# Altium schematic sheet 主控模块.SchDoc: RC1562L
size A4; Organization: 广东工程职业技术学院; Address1: 邹睿燮; Address2: 4****************9; Address3: 1905420313; SheetNumber: 2; SheetTotal: 4
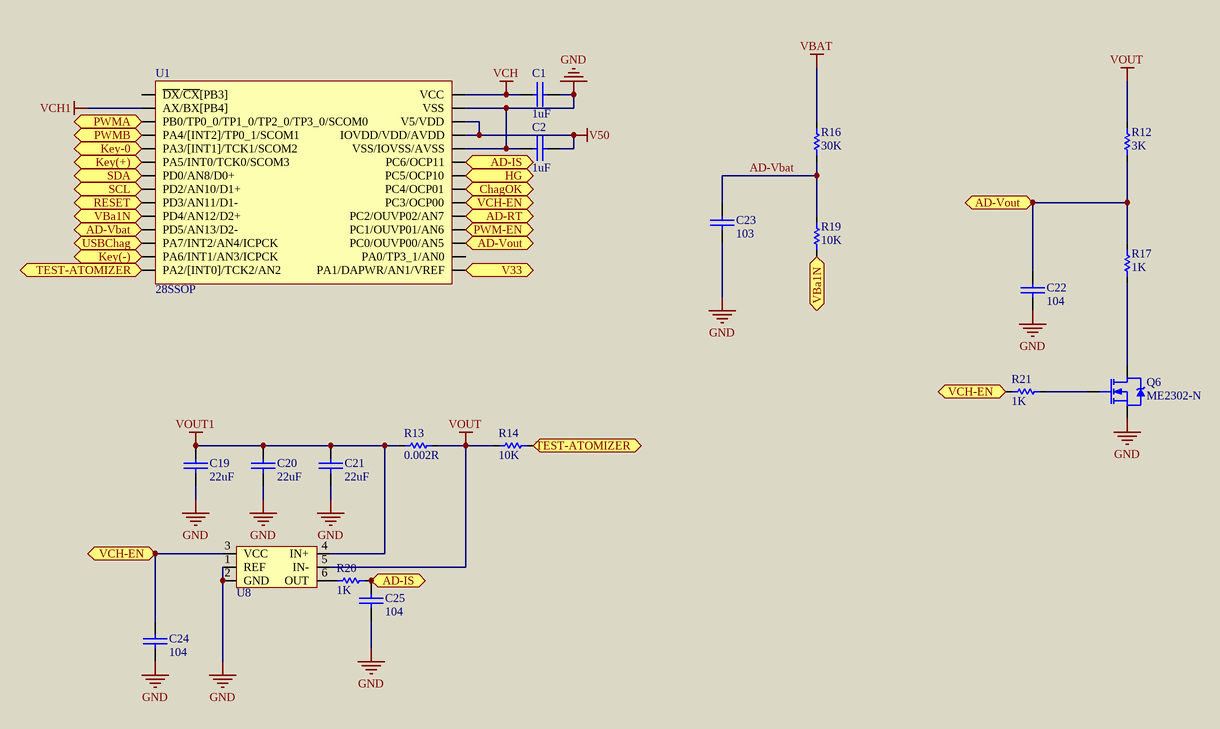
[diagram p0: 主控模块.SchDoc]

## Parts
C1  1uF  [6-0805_L]
C2  1uF  [6-0805_L]
C19  22uF  [6-0805_L]
C20  22uF  [6-0805_L]
C21  22uF  [6-0805_L]
C22  104  [6-0805_L]
C23  103  [6-0805_L]
C24  104  [6-0805_L]
C25  104  [6-0805_L]
Q6  ME2302-N  [SOT-23]
R12  3K  [6-0805_L]
R13  0.002R  [6-0805_L]
R14  10K  [6-0805_L]
R16  30K  [6-0805_L]
R17  1K  [6-0805_L]
R19  10K  [6-0805_L]
R20  1K  [6-0805_L]
R21  1K  [6-0805_L]
U1  28SSOP  [28SSOP]
U8  INA199  [SC70-6]  (value not drawn)

## Ports
AD-IS, AD-RT, AD-Vbat, AD-Vout, ChagOK, HG, Key(+), Key(-), Key-0, PWM-EN, PWMA, PWMB, RESET, SCL, SDA, TEST-ATOMIZER, USBChag, V33, VBa1N, VCH-EN

## Nets
GND: C1.2 C2.1 C19.1 C20.1 C21.1 C22.1 C23.1 C24.1 C25.1 Q6.2(S) U1.24(VSS/IOVSS/AVSS) U1.27(VSS) U8.1(REF) U8.2(GND)
V50: C2.2 U1.25(IOVDD/VDD/AVDD) U1.26(V5/VDD)
VBAT: R16.2
VCH: C1.1 U1.28(VCC)
VCH1: U1.2(AX/BX[PB4])
VOUT: R12.2 R13.2 R14.1 U8.5(IN-)
VOUT1: C19.2 C20.2 C21.2 R13.1 U8.4(IN+)
AD-IS: C25.2 R20.2 U1.23(PC6/OCP11) ; port AD-IS
AD-RT: U1.19(PC2/OUVP02/AN7) ; port AD-RT
AD-Vbat: U1.11(PD5/AN13/D2-) ; port AD-Vbat
AD-Vbat: C23.2 R16.1 R19.2  [a separate net that carries the same name]
AD-Vout: C22.2 R12.1 R17.2 U1.17(PC0/OUVP00/AN5) ; port AD-Vout
ChagOK: U1.21(PC4/OCP01) ; port ChagOK
HG: U1.22(PC5/OCP10) ; port HG
Key(+): U1.6(PA5/INT0/TCK0/SCOM3) ; port Key(+)
Key(-): U1.13(PA6/INT1/AN3/ICPCK) ; port Key(-)
Key-0: U1.5(PA3/[INT1]/TCK1/SCOM2) ; port Key-0
PWM-EN: U1.18(PC1/OUVP01/AN6) ; port PWM-EN
PWMA: U1.3(PB0/TP0_0/TP1_0/TP2_0/TP3_0/SCOM0) ; port PWMA
PWMB: U1.4(PA4/[INT2]/TP0_1/SCOM1) ; port PWMB
RESET: U1.9(PD3/AN11/D1-) ; port RESET
SCL: U1.8(PD2/AN10/D1+) ; port SCL
SDA: U1.7(PD0/AN8/D0+) ; port SDA
TEST-ATOMIZER: R14.2 U1.14(PA2/[INT0]/TCK2/AN2) ; port TEST-ATOMIZER
USBChag: U1.12(PA7/INT2/AN4/ICPCK) ; port USBChag
V33: U1.15(PA1/DAPWR/AN1/VREF) ; port V33
VBa1N: R19.1 U1.10(PD4/AN12/D2+) ; port VBa1N
VCH-EN: C24.2 R21.1 U1.20(PC3/OCP00) U8.3(VCC) ; port VCH-EN
NetQ6_1: Q6.1(G) R21.2
NetQ6_3: Q6.3(D) R17.1
NetR20_1: R20.1 U8.6(OUT)

Not connected (* = marked no-connect by the designer): U1 1(~{DX}/~{CX}[PB3]) 16(PA0/TP3_1/AN0)

## Notes on the sheet
- 单位名称
- 考生信息
- 图名
- 文件名
- 第
- 幅
- 总共
- 当前日期
- 当前时间

## Library data of the parts
C1 C2 C19-C25 = CAP: Capacitor
Q6 = NMOS-2: N-Channel Power MOSFET; Note: Pin 2 is electrically connected to pin 4.; Published: 8-Jun-2000; LatestRevisionDate: 17-Jul-2002; LatestRevisionNote: Re-released for DXP Platform.; DatasheetVersion: PD-9.814; PackageVersion: Feb-1997; PackageReference: TO-220AB; Publisher: Altium Limited; PackageDescription: TO, Thru-Hole, Vertical, Heatsink Mounted; 3 In-Line Leads; Pitch 2.54 mm; ComponentLink1Description: Manufacturer Link; ComponentLink1URL: http://www.irf.com/
R12-R14 R16 R17 R19-R21 = Res1_1: Resistor; Published: 8-Jun-2000; LatestRevisionDate: 17-Jul-2002; LatestRevisionNote: Re-released for DXP Platform.; PackageReference: AXIAL-0.3; Publisher: Altium Limited; PackageDescription: Axial Device, Thru-Hole; 2 Leads; 0.3 in Pin Spacing
U1 = HT45HF4N